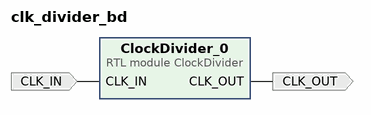
[diagram p0: block diagram of the top level]
# Vivado block design clk_divider_bd, xc7z020clg400-1, Vivado 2022.1
create_bd_design clk_divider_bd

create_bd_port -dir O CLK_OUT
create_bd_port -dir I -type clk CLK_IN
set_property -dict {CONFIG.FREQ_HZ 125000000} [get_bd_ports CLK_IN]

create_bd_cell -type module -reference ClockDivider ClockDivider_0

# ---- connections ----

connect_bd_net [get_bd_ports CLK_IN] [get_bd_pins ClockDivider_0/CLK_IN]
connect_bd_net [get_bd_pins ClockDivider_0/CLK_OUT] [get_bd_ports CLK_OUT]

validate_bd_design
save_bd_design
